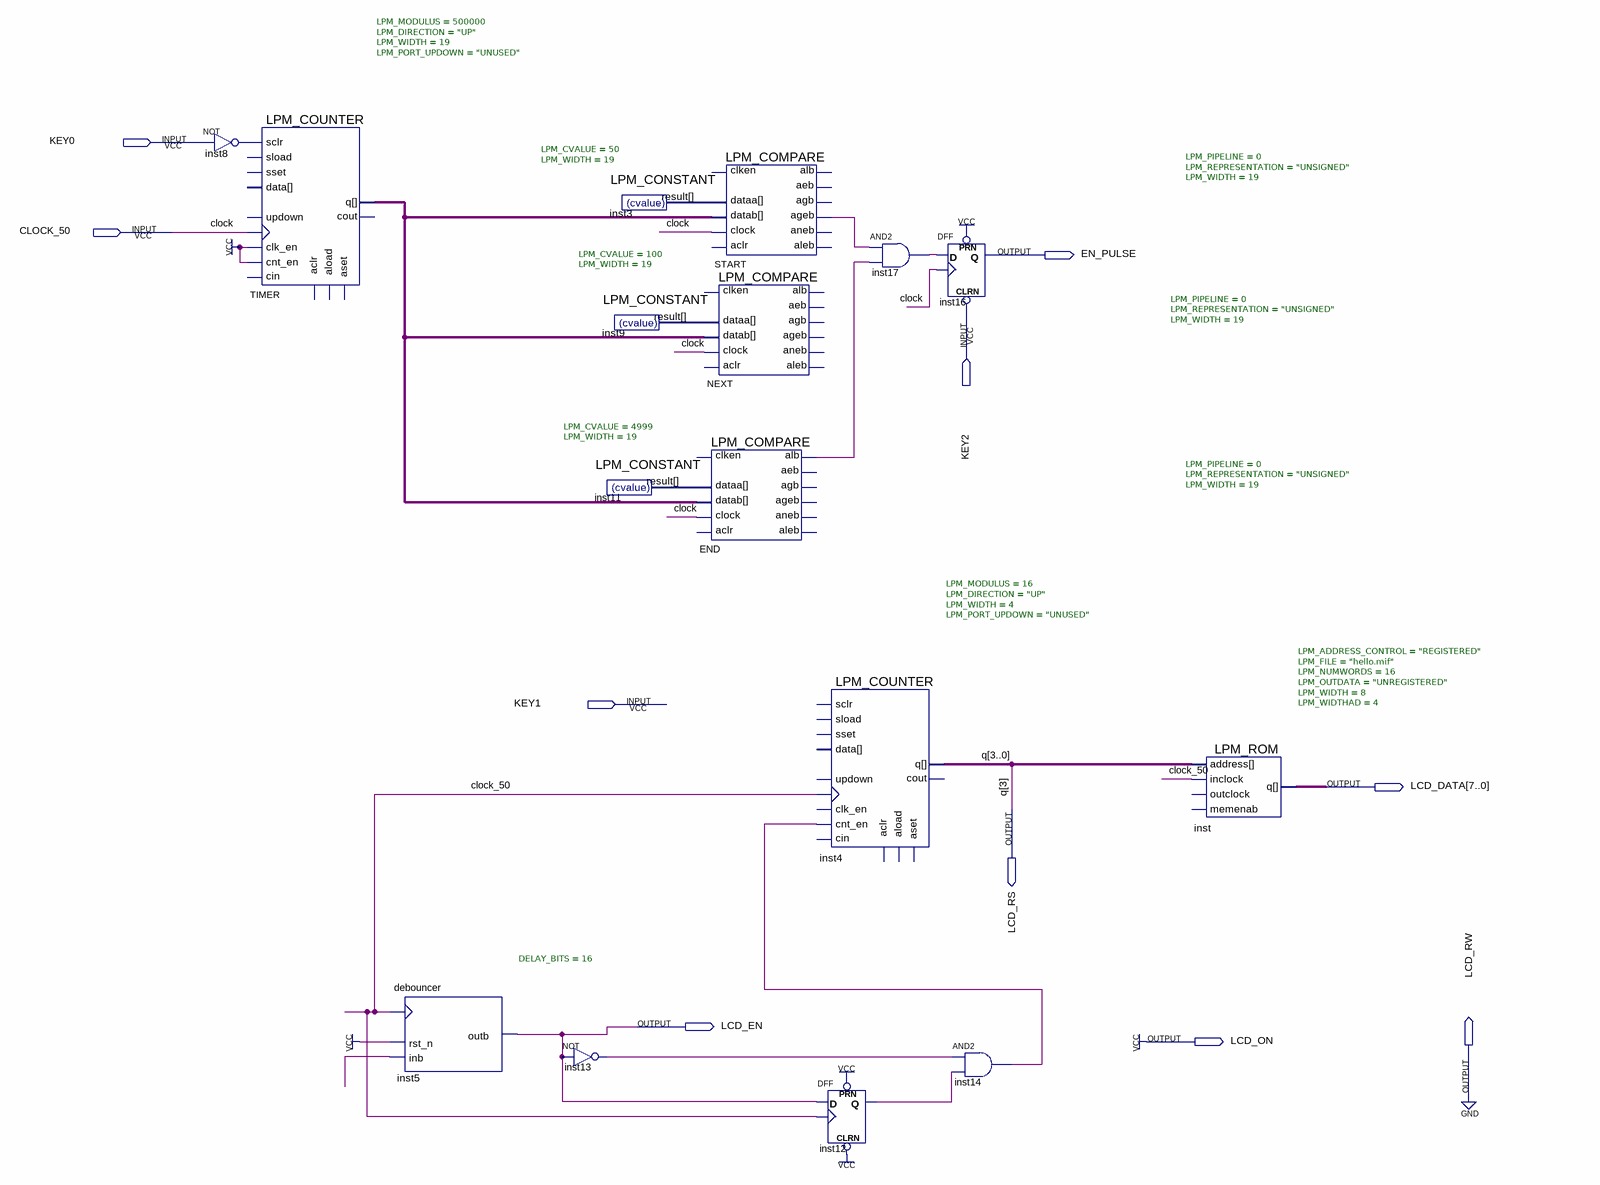
[diagram p0: schematic sheet]
// Quartus schematic teste.bdf as structural Verilog: 16 symbols, 10 pins
module teste (
  input  KEY0,
  input  CLOCK_50,
  input  KEY2,
  input  KEY1,
  output EN_PULSE,
  output [7:0] LCD_DATA,
  output LCD_RS,
  output LCD_EN,
  output LCD_ON,
  output LCD_RW
);

  wire END_alb, inst8_out, inst12_q, inst13_out, inst14_out, inst17_out, START_ageb, undriven;
  wire [2:0] q;
  wire [18:0] inst3_result, inst9_result, inst11_result, TIMER_q;

  LPM_COUNTER #(.LPM_MODULUS(500000), .LPM_DIRECTION("UP"), .LPM_WIDTH(19), .LPM_PORT_UPDOWN("UNUSED")) TIMER (
    .clock(CLOCK_50), .clk_en(1'b1), .cnt_en(1'b1), .sclr(inst8_out), .q(TIMER_q));  // open: sload, data, aload, aclr, aset, cin, sset, updown, cout
  not inst8 (inst8_out, KEY0);
  debouncer #(.DELAY_BITS(16)) inst5 (.rst_n(1'b1), .inb(undriven), .clk(CLOCK_50), .outb(LCD_EN));
  LPM_CONSTANT #(.LPM_CVALUE(50), .LPM_WIDTH(19)) inst3 (.result(inst3_result));
  LPM_CONSTANT #(.LPM_CVALUE(100), .LPM_WIDTH(19)) inst9 (.result(inst9_result));
  LPM_CONSTANT #(.LPM_CVALUE(4999), .LPM_WIDTH(19)) inst11 (.result(inst11_result));
  not inst13 (inst13_out, LCD_EN);
  LPM_COMPARE #(.LPM_PIPELINE(0), .LPM_REPRESENTATION("UNSIGNED"), .LPM_WIDTH(19)) START (
    .dataa(inst3_result), .datab(TIMER_q), .clock(CLOCK_50), .ageb(START_ageb));  // open: aclr, clken, aleb, aeb, agb, aneb, alb
  LPM_COMPARE #(.LPM_PIPELINE(0), .LPM_REPRESENTATION("UNSIGNED"), .LPM_WIDTH(19)) NEXT (
    .dataa(inst9_result), .datab(TIMER_q), .clock(CLOCK_50));  // open: aclr, clken, aleb, aeb, agb, aneb, ageb, alb
  LPM_COMPARE #(.LPM_PIPELINE(0), .LPM_REPRESENTATION("UNSIGNED"), .LPM_WIDTH(19)) END (
    .dataa(inst11_result), .datab(TIMER_q), .clock(CLOCK_50), .alb(END_alb));  // open: aclr, clken, aleb, aeb, agb, aneb, ageb
  LPM_COUNTER #(.LPM_MODULUS(16), .LPM_DIRECTION("UP"), .LPM_WIDTH(4), .LPM_PORT_UPDOWN("UNUSED")) inst4 (
    .clock(CLOCK_50), .cnt_en(inst14_out), .q({LCD_RS, q}));  // open: sload, data, clk_en, aload, aclr, aset, cin, sset, updown, sclr, cout
  DFF inst12 (.CLRN(1'b1), .CLK(CLOCK_50), .D(LCD_EN), .PRN(1'b1), .Q(inst12_q));
  and inst17 (inst17_out, START_ageb, END_alb);
  DFF inst16 (.CLRN(KEY2), .CLK(CLOCK_50), .D(inst17_out), .PRN(1'b1), .Q(EN_PULSE));
  and inst14 (inst14_out, inst13_out, inst12_q);
  LPM_ROM #(.LPM_ADDRESS_CONTROL("REGISTERED"), .LPM_FILE("hello.mif"), .LPM_NUMWORDS(16), .LPM_OUTDATA("UNREGISTERED"), .LPM_WIDTH(8), .LPM_WIDTHAD(4)) inst (
    .address({LCD_RS, q}), .inclock(CLOCK_50), .q(LCD_DATA));  // open: outclock, memenab

  assign LCD_ON = 1'b1;
  assign LCD_RW = 1'b0;

  // Other names for the same wires on the sheet: clock = CLOCK_50; q[3] = LCD_RS
endmodule
